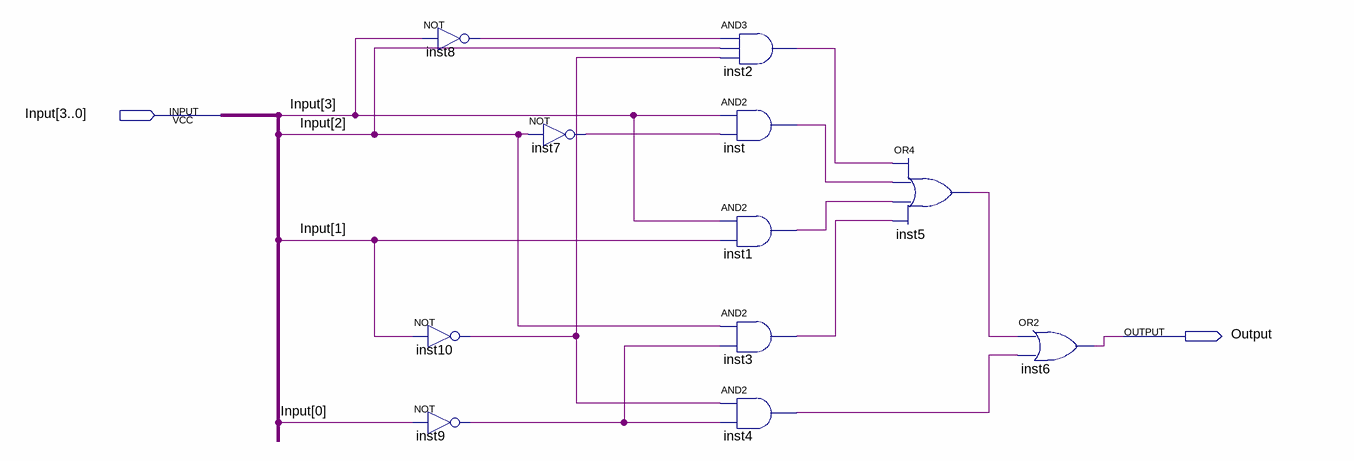
[diagram p0: schematic sheet]
// Quartus schematic display_f.bdf as structural Verilog: 11 symbols, 2 pins
module display_f (
  input  [3:0] Input,
  output Output
);

  wire inst1_out, inst2_out, inst3_out, inst4_out, inst5_out, inst7_out, inst8_out, inst9_out, inst10_out,
       inst_out;

  not inst8 (inst8_out, Input[3]);
  not inst10 (inst10_out, Input[1]);
  not inst9 (inst9_out, Input[0]);
  not inst7 (inst7_out, Input[2]);
  and inst2 (inst2_out, inst8_out, Input[2], inst10_out);
  and inst (inst_out, Input[3], inst7_out);
  and inst1 (inst1_out, Input[3], Input[1]);
  and inst3 (inst3_out, Input[2], inst9_out);
  and inst4 (inst4_out, inst10_out, inst9_out);
  or inst5 (inst5_out, inst2_out, inst_out, inst1_out, inst3_out);
  or inst6 (Output, inst5_out, inst4_out);
endmodule
